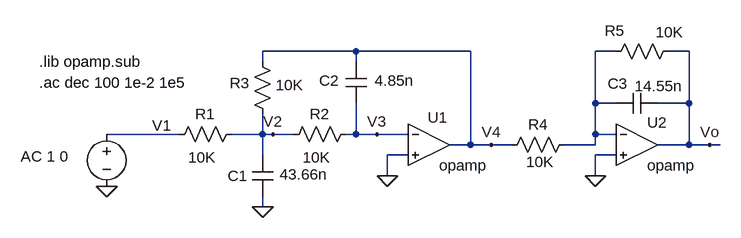
[diagram p0: schematic MFB_circuito.asc]
MFB_circuito.asc, the LTspice schematic file:
Version 4
SHEET 1 880 680
WIRE 48 -16 -96 -16
WIRE 224 -16 48 -16
WIRE 448 -16 416 -16
WIRE 560 -16 528 -16
WIRE -96 0 -96 -16
WIRE 48 0 48 -16
WIRE 416 64 416 -16
WIRE 448 64 416 64
WIRE 560 64 560 -16
WIRE 560 64 512 64
WIRE -224 112 -336 112
WIRE -96 112 -96 80
WIRE -96 112 -144 112
WIRE -80 112 -96 112
WIRE -48 112 -80 112
WIRE 48 112 48 64
WIRE 48 112 32 112
WIRE 80 112 48 112
WIRE 128 112 80 112
WIRE 416 112 416 64
WIRE 448 112 416 112
WIRE 224 128 224 -16
WIRE 224 128 192 128
WIRE 256 128 224 128
WIRE 288 128 256 128
WIRE 416 128 416 112
WIRE 416 128 368 128
WIRE 560 128 560 64
WIRE 560 128 512 128
WIRE 592 128 560 128
WIRE 608 128 592 128
WIRE -96 144 -96 112
WIRE 128 144 96 144
WIRE 448 144 416 144
WIRE 96 176 96 144
WIRE 416 176 416 144
WIRE -96 224 -96 208
FLAG 96 176 0
FLAG -96 224 0
FLAG -336 192 0
FLAG 592 128 Vo
FLAG -80 112 V2
FLAG 416 176 0
FLAG 256 128 V4
FLAG 80 112 V3
SYMBOL Opamps\\opamp 160 64 R0
WINDOW 0 -2 22 Left 2
SYMATTR InstName U1
SYMBOL res -128 96 R90
WINDOW 0 0 56 VBottom 2
WINDOW 3 36 61 VTop 2
SYMATTR InstName R1
SYMATTR Value 10K
SYMBOL cap -112 144 R0
WINDOW 0 -38 32 Left 2
WINDOW 3 42 30 Left 2
SYMATTR InstName C1
SYMATTR Value 43.66n
SYMBOL cap 64 64 R180
WINDOW 0 42 35 Left 2
WINDOW 3 -73 35 Left 2
SYMATTR InstName C2
SYMATTR Value 4.85n
SYMBOL voltage -336 96 R0
WINDOW 0 70 2 Left 2
WINDOW 3 -66 58 Left 2
WINDOW 123 -132 50 Left 2
WINDOW 39 0 0 Left 0
SYMATTR InstName V1
SYMATTR Value ""
SYMATTR Value2 AC 1 0
SYMBOL Opamps\\opamp 480 64 R0
WINDOW 0 16 30 Left 2
SYMATTR InstName U2
SYMBOL cap 512 48 R90
WINDOW 0 1 62 VBottom 2
WINDOW 3 -26 -2 VTop 2
SYMATTR InstName C3
SYMATTR Value 14.55n
SYMBOL res 384 112 R90
WINDOW 0 0 56 VBottom 2
WINDOW 3 27 53 VTop 2
SYMATTR InstName R4
SYMATTR Value 10K
SYMBOL res 544 -32 R90
WINDOW 0 0 98 VBottom 2
WINDOW 3 -29 14 VTop 2
SYMATTR InstName R5
SYMATTR Value 10K
SYMBOL res 48 96 R90
WINDOW 0 0 56 VBottom 2
WINDOW 3 36 61 VTop 2
SYMATTR InstName R2
SYMATTR Value 10K
SYMBOL res -80 96 R180
WINDOW 0 36 63 Left 2
WINDOW 3 -47 60 Left 2
SYMATTR InstName R3
SYMATTR Value 10K
TEXT -440 0 Left 2 !.lib opamp.sub
TEXT -440 32 Left 2 !.ac dec 100 1e-2 1e5

The netlist it stands for:
* MFB_circuito.asc
XU1 V3 0 V4 opamp Aol=100K GBW=10Meg  ; pins invin noninvin out
R1 V2 N002 10K
C1 V2 0 43.66n
C2 V3 V4 4.85n
V1 N002 0 AC 1 0
XU2 N001 0 Vo opamp Aol=100K GBW=10Meg  ; pins invin noninvin out
C3 Vo N001 14.55n
R4 N001 V4 10K
R5 Vo N001 10K
R2 V3 V2 10K
R3 V2 V4 10K
.lib opamp.sub
.ac dec 100 1e-2 1e5
.backanno
.end